# EAGLE design srd-05vdc-sl-c single (EAGLE 6.5.0)
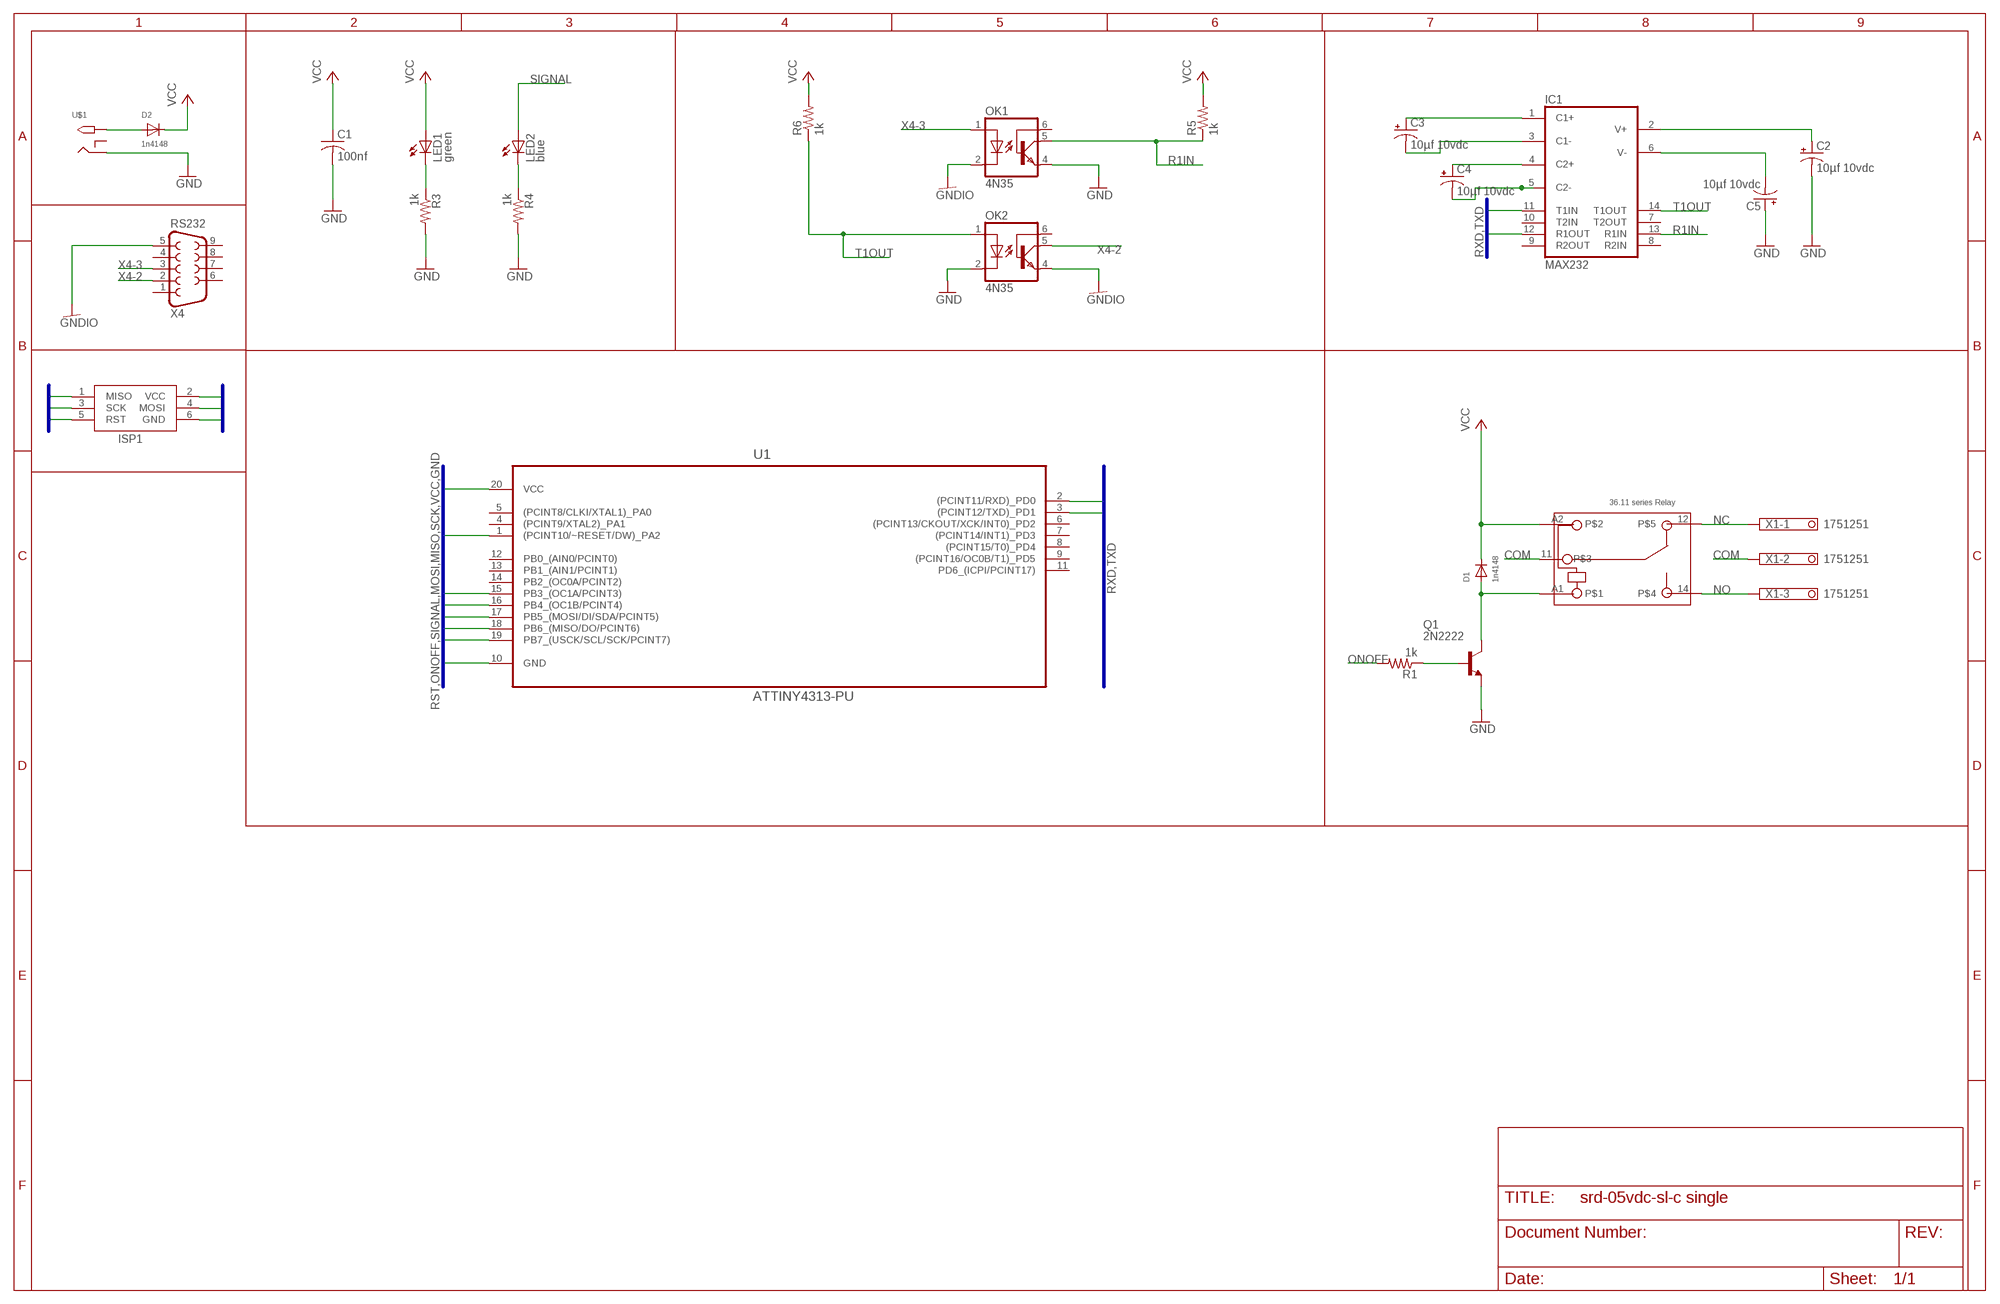
[diagram p0: schematic, sheet 1]

## Parts
C1  100nf  C-US025-025X050  [C025-025X050]
C2  10µf 10vdc  CPOL-USE2.5-6  [E2,5-6]
C3  10µf 10vdc  CPOL-USE2.5-6  [E2,5-6]
C4  10µf 10vdc  CPOL-USE2.5-6  [E2,5-6]
C5  10µf 10vdc  CPOL-USE2.5-6  [E2,5-6]
D1  1n4148  DIODEDO-1N4148  [DO-1N4148]
D2  1n4148  DIODEDO-1N4148  [DO-1N4148]
IC1  MAX232  [DIL16]
ISP1  AVRISP-6  [AVRISP]
LED1  green  LED3MM  [LED3MM]
LED2  blue  LED3MM  [LED3MM]
OK1  4N35  [DIL06]
OK2  4N35  [DIL06]
Q1  2N2222  [TO92-EBC-OVAL]
R1  1k  R-US_0204/7  [0204/7]
R3  1k  R-US_0204/7  [0204/7]
R4  1k  R-US_0204/7  [0204/7]
R5  1k  R-US_0204/7  [0204/7]
R6  1k  R-US_0204/7  [0204/7]
SRD-05VDC-SL-C  36.11  [36.11]
U1  ATTINY4313-PU  [DIP254P762X533-20]
U$1  2.1MMJACKTHM  [PJ-102A]
X1  1751251  [1751251]
X4  RS232  F09H  [F09H]

## Nets
COM: SRD-05VDC-SL-C.11 X1.2
GND: C1.2 C2.- C5.+ ISP1.6(GND) OK1.4(EMI) OK2.2(C) Q1.E R3.2 R4.2 U1.10(GND) U$1.RING
GNDIO: OK1.2(C) OK2.4(EMI) X4.5
MISO: ISP1.1(MISO) U1.18(PB6_(MISO/DO/PCINT6))
MOSI: ISP1.4(MOSI) U1.17(PB5_(MOSI/DI/SDA/PCINT5))
N$1: C5.- IC1.6(V-)
N$2: D2.A U$1.TIP
N$3: LED1.K(C) R3.1
N$4: LED2.K(C) R4.1
N$5: D1.A Q1.C SRD-05VDC-SL-C.A1
N$6: Q1.B R1.1
N$7: C3.+ IC1.1(C1+)
N$8: C3.- IC1.3(C1-)
N$9: C4.+ IC1.4(C2+)
N$10: C4.- IC1.5(C2-)
N$11: C2.+ IC1.2(V+)
NC: SRD-05VDC-SL-C.12 X1.1
NO: SRD-05VDC-SL-C.14 X1.3
ONOFF: R1.2 U1.15(PB3_(OC1A/PCINT3))
R1IN: IC1.13(R1IN) OK1.5(COL) R5.1
RST: ISP1.5(RST) U1.1((PCINT10/~RESET/DW)_PA2)
RXD: IC1.12(R1OUT) U1.2((PCINT11/RXD)_PD0)
SCK: ISP1.3(SCK) U1.19(PB7_(USCK/SCL/SCK/PCINT7))
SIGNAL: LED2.A U1.16(PB4_(OC1B/PCINT4))
T1OUT: IC1.14(T1OUT) OK2.1(A) R6.1
TXD: IC1.11(T1IN) U1.3((PCINT12/TXD)_PD1)
VCC: C1.1 D1.C D2.C ISP1.2(VCC) LED1.A R5.2 R6.2 SRD-05VDC-SL-C.A2 U1.20(VCC)
X4-2: OK2.5(COL) X4.2
X4-3: OK1.1(A) X4.3
Unconnected: IC1.7(T2OUT) IC1.8(R2IN) IC1.9(R2OUT) IC1.10(T2IN) OK1.6(BAS) OK2.6(BAS) U1.4((PCINT9/XTAL2)_PA1) U1.5((PCINT8/CLKI/XTAL1)_PA0) U1.6((PCINT13/CKOUT/XCK/INT0)_PD2) U1.7((PCINT14/INT1)_PD3) U1.8((PCINT15/T0)_PD4) U1.9((PCINT16/OC0B/T1)_PD5) U1.11(PD6_(ICPI/PCINT17)) U1.12(PB0_(AIN0/PCINT0)) U1.13(PB1_(AIN1/PCINT1)) U1.14(PB2_(OC0A/PCINT2)) U$1.RING_SW X4.1 X4.4 X4.6 X4.7 X4.8 X4.9

## Buses
MISO,SCK,RST
VCC,MOSI,GND
RST,ONOFF,SIGNAL,MOSI,MISO,SCK,VCC,GND
RXD,TXD

## Power pins joined to a net without a drawn wire
GND: IC1.15(GND)
VCC: IC1.16(VCC)

## Library data of the parts
C1 = adafruit:C-US: CAPACITOR, American symbol
C2-C5 = adafruit:CPOL-US: POLARIZED CAPACITOR, American symbol
D1 D2 = adafruit:DIODE: Diode SMADIODE - SMA Surface Mount Package 20V 1A Schottky Diode Digikey: 641-1014-6-ND DO-1N4148 - Through Hole Small Current Diode SOD-123 20V 1 A (.5mV Vf) Schottky Diode - Digikey: MBRX120TPMSCT-ND SOD-323 10V 570mA (.38mV Vf, 3ns) Schottky Diode - Digikey: ZLLS410CT-ND SOD-523 30V 30mA Schottky Diode (RB751S-40TE61) - Digikey: RB751S-40TE61CT-ND SOT23-R/W - SOT23 Package (R = Solder Paste/Reflow Ovens, W = Hand-Soldering) BAT54Film 40V 300mA - Digikey: 497-7162-1-ND
IC1 = maxim:MAX232: RS232 TRANSCEIVER; MF: MAXIM; MPN: MAX232ACPE+; OC_FARNELL: 9723773; OC_NEWARK: 68K4544
ISP1 = adafruit:AVRISP: AVR ISP HEADER Standard 6 pin header for AVR programming
LED1 LED2 = adafruit:LED: LED OSRAM: - CHIPLED LG R971, LG N971, LY N971, LG Q971, LY Q971, LO R971, LY R971 LH N974, LH R974 LS Q976, LO Q976, LY Q976 LO Q996 - Hyper CHIPLED LW Q18S LB Q993, LB Q99A, LB R99A - SideLED LS A670, LO A670, LY A670, LG A670, LP A670 LB A673, LV A673, LT A673, LW A673 LH A674 LY A675 LS A676, LA A676, LO A676, LY A676, LW A676 LS A679, LY A679, LG A679 - Hyper Micro SIDELED® LS Y876, LA Y876, LO Y876, LY Y876 LT Y87S - SmartLED LW L88C, LW L88S LB L89C, LB L89S, LG L890 LS L89K, LO L89K, LY L89K LS L896, LA L896, LO L896, LY L896 - TOPLED LS T670, LO T670, LY T670, LG T670, LP T670 LSG T670, LSP T670, LSY T670, LOP T670, LYG T670 LG T671, LOG T671, LSG T671 LB T673, LV T673, LT T673, LW T673 LH T674 LS T676, LA T676, LO T676, LY T676, LB T676, LH T676, LSB T676, LW T676 LB T67C, LV T67C, LT T67C, LS T67K, LO T67K, LY T67K, LW E67C LS E67B, LA E67B, LO E67B, LY E67B, LB E67C, LV E67C, LT E67C LW T67C LS T679, LY T679, LG T679 LS T770, LO T770, LY T770, LG T770, LP T770 LB T773, LV T773, LT T773, LW T773 LH T774 LS E675, LA E675, LY E675, LS T675 LS T776, LA T776, LO T776, LY T776, LB T776 LHGB T686 LT T68C, LB T68C - Hyper Mini TOPLED® LB M676 - Mini TOPLED Santana® LG M470 LS M47K, LO M47K, LY M47K Source: http://www.osram.convergy.de/
OK1 OK2 = optocoupler:4N35: MOTOROLA OPTO COUPLER; MF: FAIRCHILD SEMICONDUCTOR; MPN: 4N35; OC_FARNELL: 1328375; OC_NEWARK: 72K9946
Q1 = adafruit:2N2222: NPN TRANSISTOR Big oval pads
R1 R3-R6 = adafruit:R-US_: RESISTOR, American symbol
SRD-05VDC-SL-C = relay_finder_36_11:36.11: Printed circuit mount miniature 10 A relay one pole changeover contacts Conform RoHS
U1 = Atmel_By_element14_Batch_1-00:ATTINY4313-PU: 8-bit Microcontroller; DESCRIPTION: 8-bit Microcontroller; MPN: ATTINY4313-PU; OC_FARNELL: 1841620; OC_NEWARK: 12T1339; PACKAGE: DIP-20; SUPPLIER: Atmel
U$1 = adafruit:2.1MMJACK: 2.1mm x 5.5mm THM DC jack with internal switch. Digikey part #PJ-102A, 4UCON part #05537 2.1mm x 5.5mm SMT DC jack with internal switch. Digikey part #PJ-002A-SMT, 4UCON part #03267 By microbuilder.eu & adafruit.com
X1 = con-phoenix-350:1751251: MKDS 1/ 3-3,5 Printklemme Nennstrom: 10 A Bemessungsspannung: 160 V Raster: 3,5 mm Polzahl: 3 Montageart: Löten Anschlussart: Schraubanschluss Anschlussrichtung vom Leiter zur Platine: 0° Source: http://eshop.phoenixcontact.com .. 1751251.pdf; OC_FARNELL: unknown; OC_NEWARK: unknown
X4 = con-subd:F09: SUB-D; OC_FARNELL: unknown; OC_NEWARK: unknown

## Board
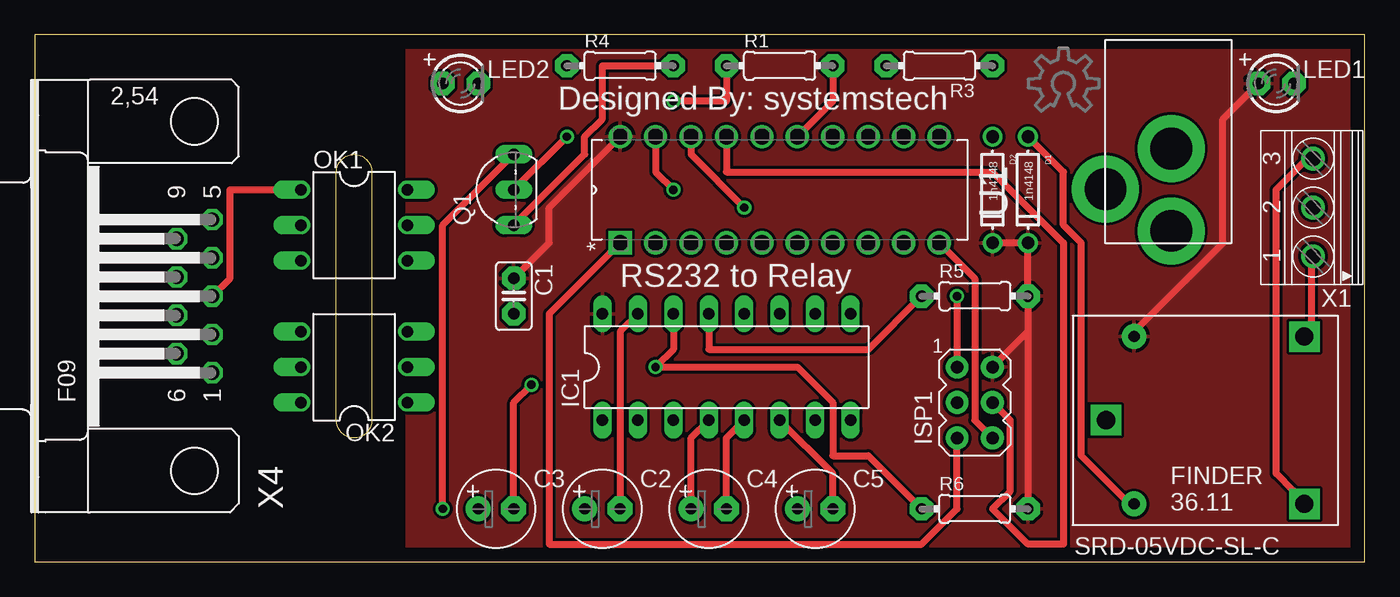
[diagram p1: board, top side]
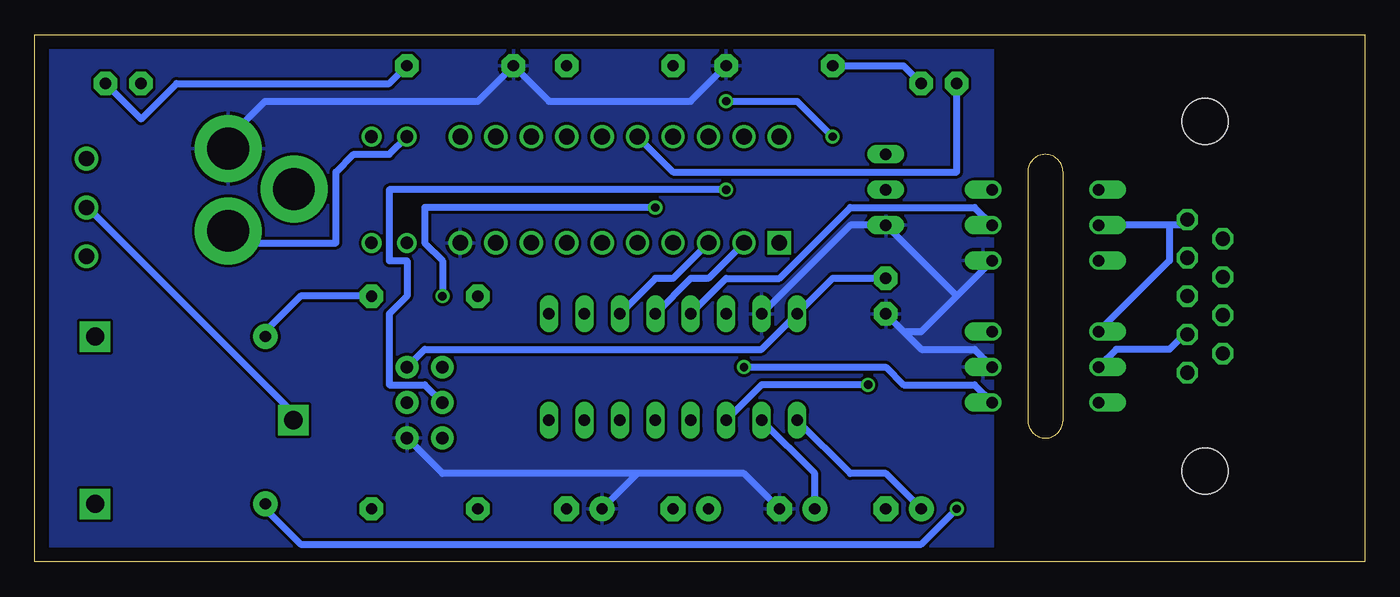
[diagram p2: board, bottom side, seen from below]

Size 95.23 x 37.77 mm. Coordinates in mm from the lower left corner, seen from the top.
Outline: 0,0 95.23,0 95.23,37.77 0,37.77 0,0
Copper layers (1*16): Top 0.035mm / dielectric 1.5mm / Bottom 0.035mm
Design rules "default *": minimum track width 20mil, minimum drill 0.6mm, track to track 8mil, track to pad 8mil, pad to pad 8mil, via to via 8mil, smd to smd 8mil, copper to edge 40mil, drill to drill 8mil, minimum pad ring 10mil, minimum via ring 8mil, stop-mask expansion 4mil, vias tented up to drill 0mil, thermal gap 10mil
tRestrict: area 20.3,0 to 25.4,38.1
bRestrict: area 20.3,0 to 25.4,38.1
Milling: area 21.6,8.9 to 24.1,29.2

### Footprints (pad centres in the part's own frame; a part is rotated, then mirrored left to right if it is on the bottom)
C025-025X050 = drill 0.813 pad 1.676 octagon: 1 -1.27,0; 2 1.27,0
E2,5-6 = drill 0.813 pad 1.778: + -1.27,0 | drill 0.813 pad 1.778 octagon: - 1.27,0
DO-1N4148 = drill 0.9: A -3.81,0; C 3.81,0
DIL16 = drill 0.813 long: 1 -8.89,-3.81; 2 -6.35,-3.81; 3 -3.81,-3.81; 4 -1.27,-3.81; 5 1.27,-3.81; 6 3.81,-3.81; 7 6.35,-3.81; 8 8.89,-3.81; 9 8.89,3.81; 10 6.35,3.81; 11 3.81,3.81; 12 1.27,3.81; 13 -1.27,3.81; 14 -3.81,3.81; 15 -6.35,3.81; 16 -8.89,3.81
AVRISP = drill 0.9 pad 1.626: 1 -1.27,2.54; 2 1.27,2.54; 3 -1.27,0; 4 1.27,0; 5 -1.27,-2.54; 6 1.27,-2.54
LED3MM = drill 0.813 pad 1.676 octagon: A -1.27,0; K 1.27,0
DIL06 = drill 0.813 offset: 1 -2.54,-3.81; 2 0,-3.81; 3 2.54,-3.81; 4 2.54,3.81; 5 0,3.81; 6 -2.54,3.81
TO92-EBC-OVAL = drill 0.813 long: B 0,-1.27; C 2.54,-1.27; E -2.54,-1.27
0204/7 = drill 0.813 pad 1.676 octagon: 1 -3.81,0; 2 3.81,0
36.11 = drill 1.3 pad 2.184 square: 11 -7.1,0; 12 7.1,6; 14 7.1,-6 | drill 0.8 pad 1.778: A1 -5.1,-6; A2 -5.1,6
DIP254P762X533-20 = drill 1.118 square: 1 -7.62,22.86 | drill 1.118: 2 -7.62,20.32; 3 -7.62,17.78; 4 -7.62,15.24; 5 -7.62,12.7; 6 -7.62,10.16; 7 -7.62,7.62; 8 -7.62,5.08; 9 -7.62,2.54; 10 -7.62,0; 11 0,0; 12 0,2.54; 13 0,5.08; 14 0,7.62; 15 0,10.16; 16 0,12.7; 17 0,15.24; 18 0,17.78; 19 0,20.32; 20 0,22.86
PJ-102A = drill 3 pad 4.8: RING 0.1,-3.39; RING_SW -4.6,-6.29; TIP 0.1,-9.29
1751251 = drill 1.1 pad 1.7: 1 -3.5,-0.1; 2 0,-0.1; 3 3.5,-0.1
F09H = drill 1.016 octagon: 1 -5.486,-1.27; 2 -2.743,-1.27; 3 0,-1.27; 4 2.743,-1.27; 5 5.486,-1.27; 6 -4.115,1.27; 7 -1.372,1.27; 8 1.372,1.27; 9 4.115,1.27 | hole 3.302: -12.522,0; 12.522,0

### Placement (x,y rotation side)
C1  34.29,19.05 270 top
C2  40.64,3.81 0 top
C3  33.02,3.81 0 top
C4  48.26,3.81 0 top
C5  55.88,3.81 0 top
D1  71.12,26.67 270 top
D2  68.58,26.67 270 top
IC1  49.53,13.97 0 top
ISP1  67.31,11.43 0 top
LED1  88.9,34.29 0 top
LED2  30.48,34.29 0 top
OK1  22.86,24.13 270 top
OK2  22.86,13.97 90 top
Q1  33.02,26.67 90 top
R1  53.34,35.56 0 top
R3  64.77,35.56 180 top
R4  41.91,35.56 0 top
R5  67.31,19.05 0 top
R6  67.31,3.81 0 top
SRD-05VDC-SL-C  83.82,10.16 0 top
U1  64.77,30.48 90 top
U$1  81.28,33.02 0 top
U$2  [OSHWLOGO_TOL_0.2]  73.66,34.29 0 top
X1  91.44,25.4 90 top
X4  11.43,19.05 90 top

### Tracks (layer width: path | path; a pad name or v marks a point on that pad's centre or on a via)
COM
  Bottom 0.508: X1.2 91.44,25.4 76.2,10.16 SRD-05VDC-SL-C.11
GND
  Top 0.508: ISP1.6 67.31,10.16 67.31,20.32 U1.10 | C2.- 41.91,16.51 IC1.15 | R4.2 40.64,35.56 40.64,31.75 39.37,30.48 39.37,29.21 Q1.E
  Bottom 0.508: R4.2 48.26,33.02 58.42,33.02 R3.2 63.5,33.02 78.74,33.02 81.28,30.48 U$1.RING | OK2.2 27.94,15.24 31.75,15.24 33.02,16.51 | C1.2 33.02,16.51 | 29.21,19.05 31.75,16.51 33.02,16.51 | 29.21,19.05 OK1.4 | 29.21,19.05 Q1.E 36.83,24.13 IC1.15 | 52.07,6.35 C5.+ | 52.07,6.35 44.45,6.35 C2.- | ISP1.6 66.04,6.35 52.07,6.35
  pour Bottom: 26.67,0 95.25,0 95.25,38.1 26.67,38.1
GNDIO
  Bottom 0.508: OK2.4 13.97,21.59 13.97,24.13 | 13.97,24.13 12.7,24.13 X4.5 | 13.97,24.13 OK1.2
MISO  (via drill 0.6)
  Top 0.508: v66.04,19.05 ISP1.1 | v50.8,25.4 46.99,29.21 U1.18
  Bottom 0.508: v66.04,19.05 66.04,21.59 67.31,22.86 67.31,25.4 v50.8,25.4
MOSI
  Top 0.508: ISP1.4 69.85,10.16 69.85,5.08 68.58,3.81 71.12,1.27 73.66,1.27 73.66,22.86 68.58,27.94 49.53,27.94 U1.17
N$1
  Top 0.508: IC1.6 57.15,6.35 C5.-
N$2
  Bottom 0.508: D2.A 69.85,29.21 72.39,29.21 73.66,27.94 73.66,22.86 81.28,22.86 U$1.TIP
N$3
  Bottom 0.508: R3.1 69.85,34.29 85.09,34.29 87.63,31.75 LED1.K
N$4
  Bottom 0.508: LED2.K 33.02,35.56 R4.1
N$5  (via drill 0.6)
  Top 0.508: Q1.C 29.21,24.13 v29.21,3.81 | D1.A 73.66,27.94 73.66,24.13 74.93,22.86 74.93,7.62 78.74,3.81 SRD-05VDC-SL-C.A1
  Bottom 0.508: v29.21,3.81 31.75,1.27 76.2,1.27 78.74,3.81 SRD-05VDC-SL-C.A1
N$6  (via drill 0.6)
  Top 0.508: v38.1,30.48 Q1.B | v45.72,33.02 49.53,33.02 R1.1
  Bottom 0.508: v38.1,30.48 40.64,33.02 v45.72,33.02
N$7
  Bottom 0.508: IC1.1 36.83,6.35 34.29,6.35 C3.+
N$8  (via drill 0.6)
  Top 0.508: v35.56,12.7 34.29,11.43 C3.-
  Bottom 0.508: IC1.3 43.18,12.7 v35.56,12.7
N$9
  Top 0.508: IC1.4 46.99,8.89 C4.+
N$10
  Top 0.508: IC1.5 49.53,8.89 C4.-
N$11
  Bottom 0.508: IC1.2 39.37,6.35 C2.+
NC
  Top 0.508: X1.1 91.44,21.59 91.44,16.51 SRD-05VDC-SL-C.12
NO
  Top 0.508: X1.3 91.44,29.21 88.9,26.67 88.9,6.35 90.17,5.08 SRD-05VDC-SL-C.14
ONOFF
  Top 0.508: U1.15 57.15,33.02 R1.2
R1IN
  Top 0.508: R5.1 59.69,15.24 48.26,15.24 IC1.13
  Bottom 0.508: OK1.5 27.94,25.4 36.83,25.4 41.91,20.32 45.72,20.32 IC1.13
RST
  Top 0.508: ISP1.5 66.04,3.81 63.5,1.27 36.83,1.27 36.83,17.78 U1.1
RXD
  Bottom 0.508: IC1.12 48.26,20.32 46.99,20.32 U1.2
SCK  (via drill 0.6)
  Top 0.508: v45.72,26.67 44.45,27.94 U1.19
  Bottom 0.508: ISP1.3 67.31,12.7 69.85,12.7 69.85,17.78 68.58,19.05 68.58,21.59 69.85,21.59 69.85,26.67 v45.72,26.67
SIGNAL
  Bottom 0.508: LED2.A 29.21,27.94 49.53,27.94 U1.16
T1OUT  (via drill 0.6)
  Top 0.508: IC1.14 45.72,15.24 v44.45,13.97 54.61,13.97 57.15,11.43 57.15,7.62 59.69,7.62 R6.1
  Bottom 0.508: OK2.1 27.94,12.7 33.02,12.7 34.29,13.97 v44.45,13.97
TXD
  Bottom 0.508: IC1.11 50.8,20.32 49.53,20.32 U1.3
VCC
  Top 0.508: LED1.A 85.09,31.75 85.09,22.86 78.74,16.51 SRD-05VDC-SL-C.A2 | U1.20 36.83,25.4 36.83,22.86 C1.1 | D2.C D1.C R5.2 71.12,16.51 | 71.12,16.51 ISP1.2 | 71.12,16.51 R6.2
  Bottom 0.508: C1.1 38.1,20.32 IC1.16 43.18,15.24 67.31,15.24 ISP1.2 | R5.2 76.2,19.05 78.74,16.51 SRD-05VDC-SL-C.A2
  pour Top: 26.67,0 95.25,0 95.25,38.1 26.67,38.1
X4-2
  Bottom 0.508: OK2.5 17.78,15.24 13.97,15.24 12.7,16.51 X4.2
X4-3
  Top 0.508: OK1.1 13.97,26.67 13.97,20.32 X4.3

### Text on the board
_tsilk: Designed By: systemstech | RS232 to Relay